# Altium schematic sheet EM-Lite.SchDoc
size A4
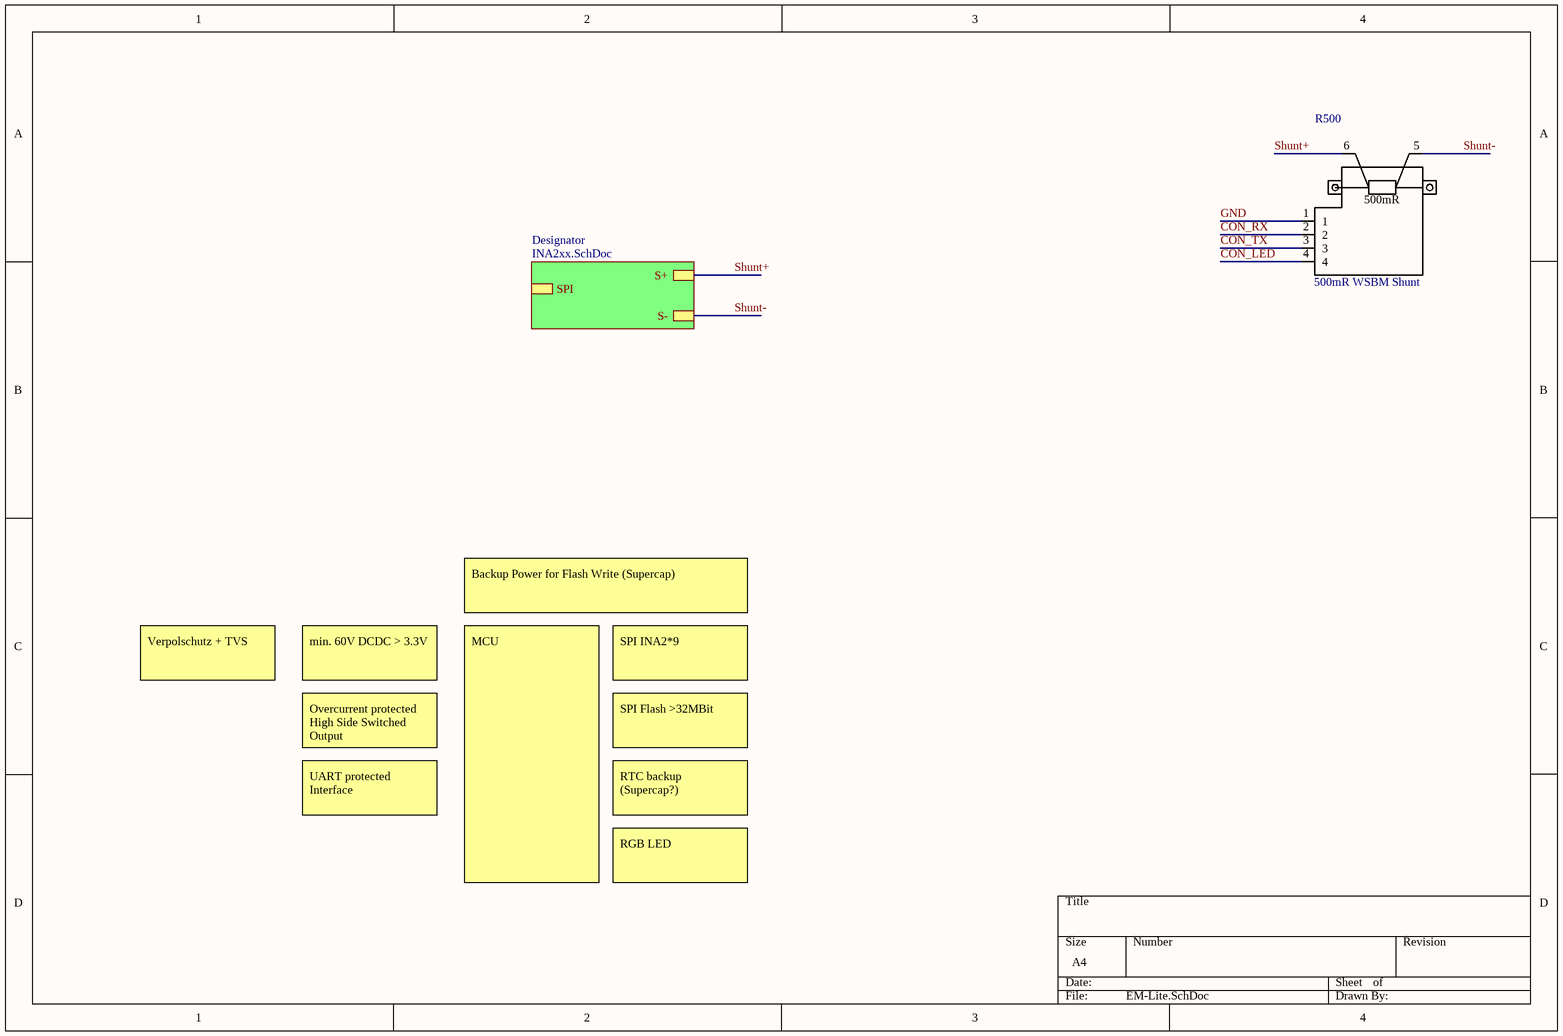
[diagram p0: EM-Lite.SchDoc]

## Parts
R500  500mR WSBM Shunt  [500mR]

## Sub-sheets
Designator = INA2xx.SchDoc: S+, SPI (harness SPI), S-

## Nets
CON_LED: R500.4
CON_RX: R500.2
CON_TX: R500.3
GND: R500.1
Shunt+: R500.6 ; sheet Designator/S+
Shunt-: R500.5 ; sheet Designator/S-

## Notes on the sheet
- Backup Power for Flash Write (Supercap)
- Verpolschutz + TVS
- min. 60V DCDC > 3.3V
- SPI INA2*9
- Overcurrent protected High Side Switched Output
- SPI Flash >32MBit
- UART protected Interface
- RTC backup (Supercap?)
- MCU
- RGB LED
- (in symbol Shunt_500mR) 500mR

## Library data of the parts
R500 = Shunt_500mR: Power Metal Strip® Battery Shunt Resistor W/Molded Enclosure / Very Low Value (50 μR, 100 μR, 125 μR, and 500 μR); Manufacturer: Vishay; Manufacturer Part Number: WSBM8518L5000